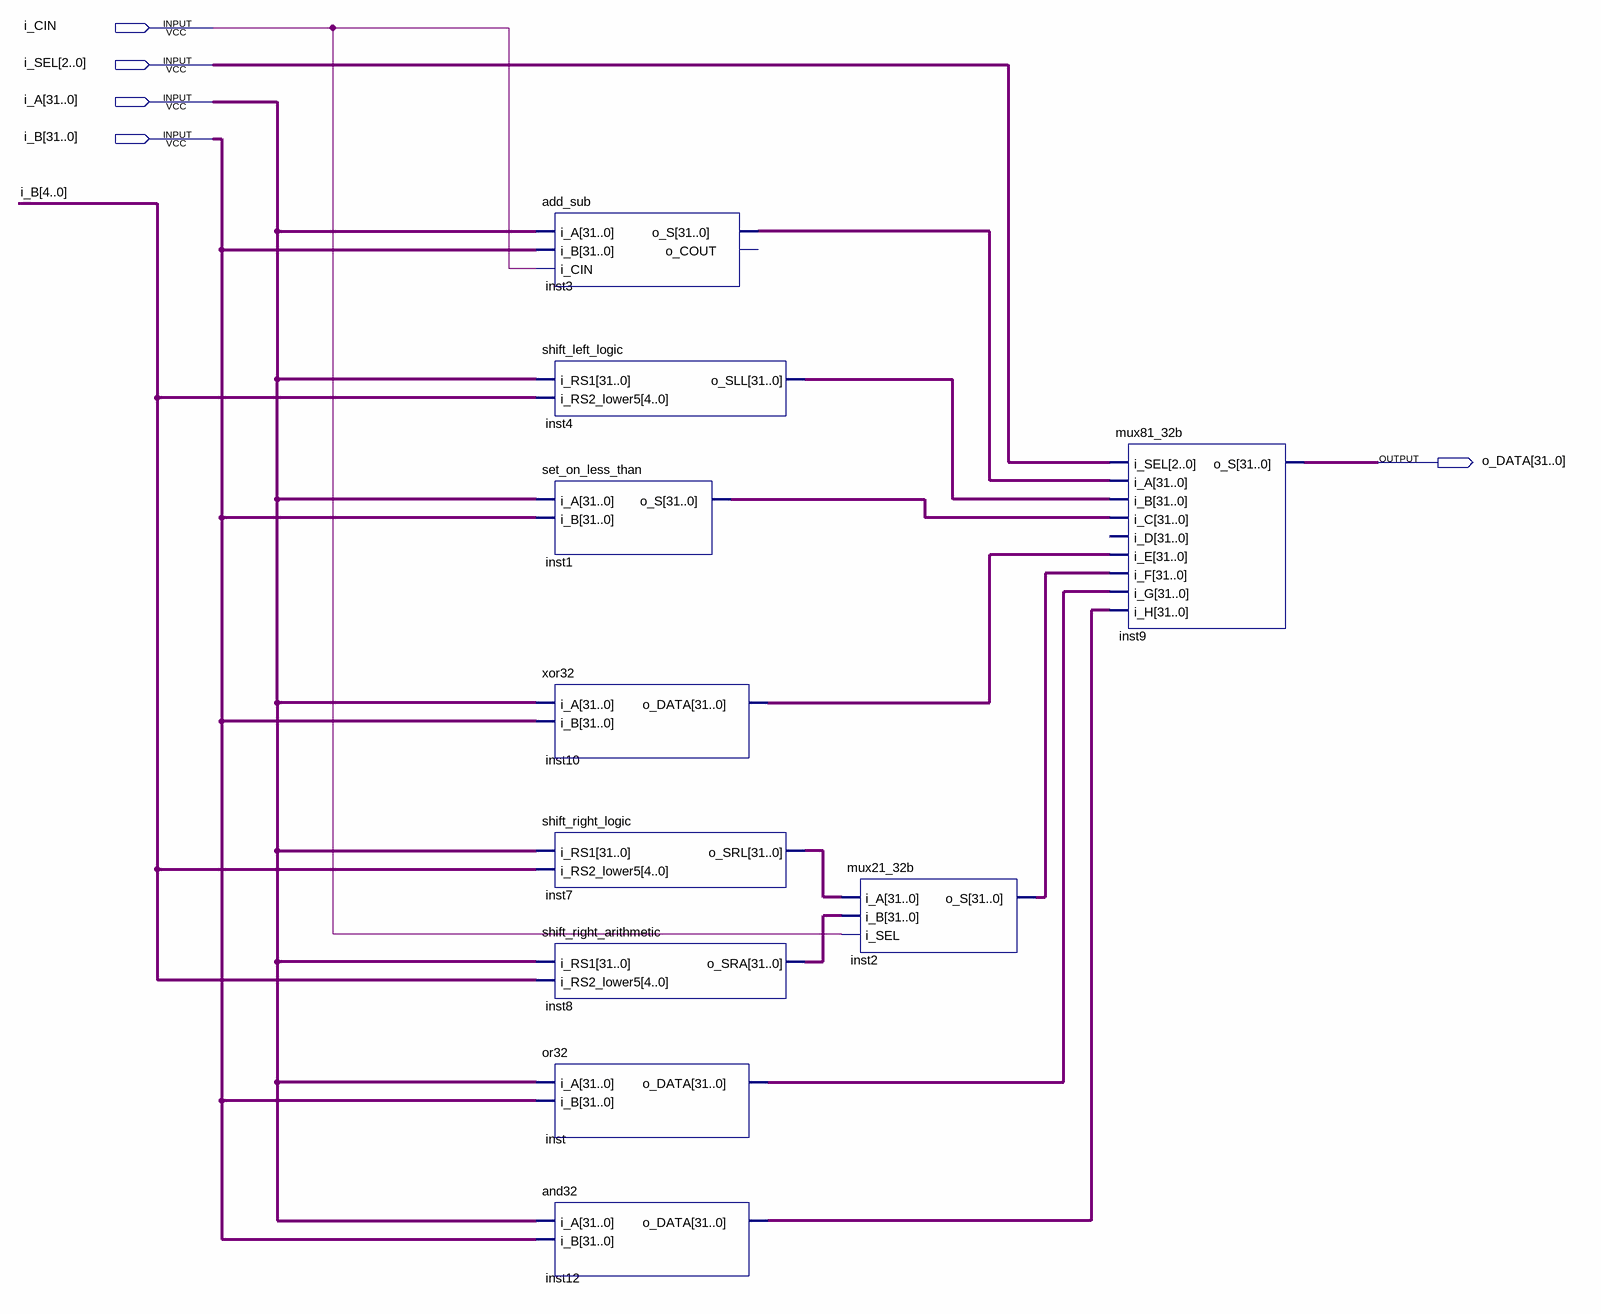
[diagram p0: schematic sheet]
// Quartus schematic ula_32b.bdf as structural Verilog: 10 symbols, 5 pins
module ula_32b (
  input  i_CIN,
  input  [2:0] i_SEL,
  input  [31:0] i_A,
  input  [31:0] i_B,
  output [31:0] o_DATA
);

  wire [31:0] inst1_o_s, inst2_o_s, inst3_o_s, inst4_o_sll, inst7_o_srl, inst8_o_sra, inst10_o_data,
       inst12_o_data, inst_o_data;

  add_sub inst3 (.i_A(i_A), .i_B(i_B), .i_CIN(i_CIN), .o_S(inst3_o_s));  // open: o_COUT
  shift_left_logic inst4 (.i_RS1(i_A), .i_RS2_lower5(i_B[4:0]), .o_SLL(inst4_o_sll));
  set_on_less_than inst1 (.i_A(i_A), .i_B(i_B), .o_S(inst1_o_s));
  xor32 inst10 (.i_A(i_A), .i_B(i_B), .o_DATA(inst10_o_data));
  shift_right_logic inst7 (.i_RS1(i_A), .i_RS2_lower5(i_B[4:0]), .o_SRL(inst7_o_srl));
  shift_right_arithmetic inst8 (.i_RS1(i_A), .i_RS2_lower5(i_B[4:0]), .o_SRA(inst8_o_sra));
  or32 inst (.i_A(i_A), .i_B(i_B), .o_DATA(inst_o_data));
  and32 inst12 (.i_A(i_A), .i_B(i_B), .o_DATA(inst12_o_data));
  mux21_32b inst2 (.i_A(inst7_o_srl), .i_B(inst8_o_sra), .i_SEL(i_CIN), .o_S(inst2_o_s));
  mux81_32b inst9 (
    .i_SEL(i_SEL), .i_A(inst3_o_s), .i_B(inst4_o_sll), .i_C(inst1_o_s), .i_E(inst10_o_data), .i_F(inst2_o_s),
    .i_G(inst_o_data), .i_H(inst12_o_data), .o_S(o_DATA));  // open: i_D
endmodule
